# EAGLE schematic BLE-Modul (EAGLE 7.0.0)
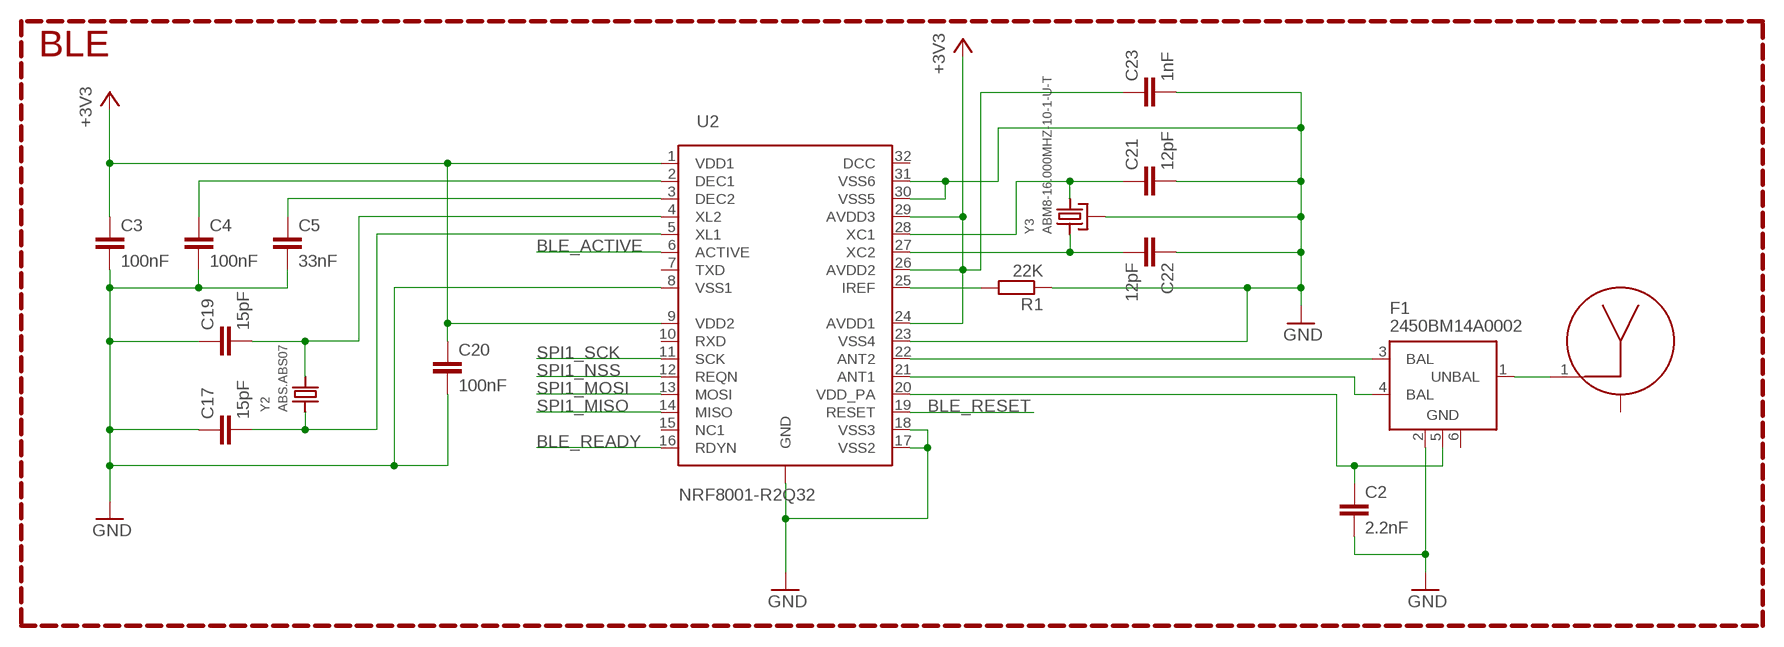
[diagram p0: schematic, sheet 1]

## Parts
A1  2450AT18A100  [2450AT18A100E]
C2  2.2nF  C-EUC0402K  [C0402K]
C3  100nF  C-EUC0402K  [C0402K]
C4  100nF  C-EUC0402K  [C0402K]
C5  33nF  C-EUC0402K  [C0402K]
C17  15pF  C-EUC0402K  [C0402K]
C19  15pF  C-EUC0402K  [C0402K]
C20  100nF  C-EUC0402K  [C0402K]
C21  12pF  C-EUC0402K  [C0402K]
C22  12pF  C-EUC0402K  [C0402K]
C23  1nF  C-EUC0402K  [C0402K]
F1  2450BM14A0002  [2450BM14A0002]
R1  22K  R-EU_R0402  [R0402]
U2  NRF8001-R2Q32  [QFN32]
Y2  ABS.ABS07  [ABS07]
Y3  ABM8-16.000MHZ-10-1-U-T  [3.2X2.5MM]

## Nets
+3V3: C3.1 C20.1 C23.1 U2.1(VDD1) U2.9(VDD2) U2.24(AVDD1) U2.26(AVDD2) U2.29(AVDD3)
BLE_ACTIVE: U2.6(ACTIVE)
BLE_READY: U2.16(RDYN)
BLE_RESET: U2.19(RESET)
GND: C2.2 C3.2 C4.2 C5.2 C17.1 C19.1 C20.2 C21.2 C22.1 C23.2 F1.2(GND) R1.1 U2.8(VSS1) U2.17(VSS2) U2.18(VSS3) U2.23(VSS4) U2.30(VSS5) U2.31(VSS6) U2.P$1(GND) Y3.2(GND) Y3.4(GND)
N$2: C21.1 U2.28(XC1) Y3.3
N$3: R1.2 U2.25(IREF)
N$4: F1.3(BAL) U2.22(ANT2)
N$5: F1.4(BAL) U2.21(ANT1)
N$9: A1.1 F1.1(UNBAL)
N$10: C4.1 U2.2(DEC1)
N$11: C5.1 U2.3(DEC2)
N$12: C17.2 U2.5(XL1) Y2.1
N$13: C19.2 U2.4(XL2) Y2.2
N$14: C22.2 U2.27(XC2) Y3.1
N$16: C2.1 F1.5(GND) U2.20(VDD_PA)
SPI1_MISO: U2.14(MISO)
SPI1_MOSI: U2.13(MOSI)
SPI1_NSS: U2.12(REQN)
SPI1_SCK: U2.11(SCK)
Unconnected: A1.2 F1.6(GND) U2.7(TXD) U2.10(RXD) U2.15(NC1)

## Notes on the sheet
- BLE

## Power pins joined to a net without a drawn wire
DCC: U2.32(DCC)

## Library data of the parts
A1 = johanson-technology:2450AT18A100: JOHANSON TECHNOLOGY 2450AT18A100E ANTENNE, KERAMIK, 2.45GHZ Mini 2.45 GHz Antenna Input Power 2W max. (CW) Impedance 50 Ω Operating Temperature -40 to +125°C Peak Gain 0.5 dBi typ. (XZ-V) Average Gain -0.5 dBi typ. (XZ-V) Return Loss 9.5 dB min.; OC_FARNELL: 1885496RL
C2-C5 C17 C19-C23 = rcl:C-EU: CAPACITOR, European symbol; OC_FARNELL: 2426952RL
F1 = JohansonTechnology:2450BM14A0002: 2.45 GHz Impedance Matched Balun-Filter: Optimized for Nordic's Chipset nRF24L01, nRF24L01+, nRF24LE1, nRF24LU1, nRF24AP2, and nRF8001 Data sheet <http://www.johansontechnology.com/datasheets/baluns/Balun_Filter_Matched_2450BM14A0002_v2.pdf>; OC_FARNELL: 2148533RL
R1 = rcl:R-EU_: RESISTOR, European symbol; OC_FARNELL: 2302957RL
U2 = Nordic:NRF8001: nRF8001 - Bluetooth Smart Connectivity IC Single-chip Bluetooth® low energy solution Datenblatt <https://www.nordicsemi.com/eng/content/download/2981/38488/file/nRF8001_PS_v1.3.pdf>; OC_DISTRELEC: 17831036
Y2 = abracon:ABS; OC_FARNELL: 2467865RL
Y3 = abracon:ABM; OC_FARNELL: 2467830RL